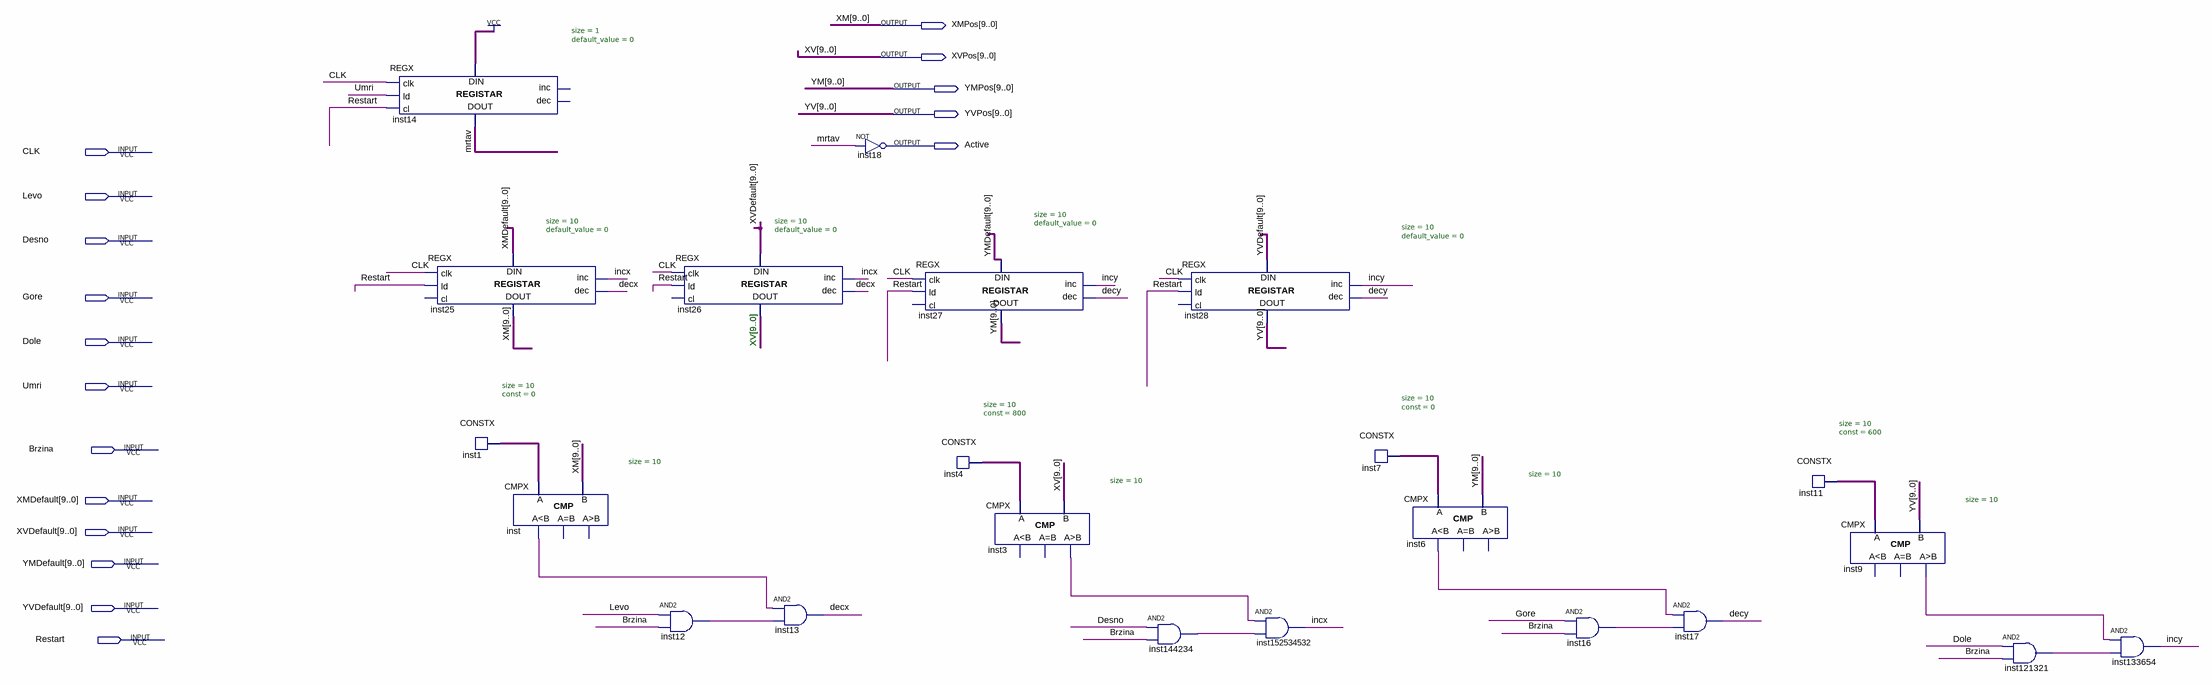
[diagram p0: schematic sheet]
// Quartus schematic objekat.bdf as structural Verilog: 22 symbols, 17 pins
module objekat (
  input  CLK,
  input  Levo,
  input  Desno,
  input  Gore,
  input  Dole,
  input  Umri,
  input  Brzina,
  input  [9:0] XMDefault,
  input  [9:0] XVDefault,
  input  [9:0] YMDefault,
  input  [9:0] YVDefault,
  input  Restart,
  output [9:0] XMPos,
  output [9:0] XVPos,
  output [9:0] YMPos,
  output [9:0] YVPos,
  output Active
);

  wire decx, decy, incx, incy, inst3_gr, inst6_ls, inst9_gr, inst12_out, inst16_out, inst121321_out,
       inst144234_out, inst_ls, mrtav;
  wire [9:0] inst1_data, inst4_data, inst7_data, inst11_data;

  REGX #(.size(1), .default_value(0)) inst14 (
    .clk(CLK), .ld(Umri), .cl(Restart), .data_in(1'b1), .data_out(mrtav));  // open: inc, dec
  REGX #(.size(10), .default_value(0)) inst25 (
    .clk(CLK), .ld(Restart), .inc(incx), .dec(decx), .data_in(XMDefault), .data_out(XMPos));  // open: cl
  CONSTX #(.size(10), .\const (0)) inst1 (.data(inst1_data));
  CMPX #(.size(10)) inst (.A(inst1_data), .B(XMPos), .ls(inst_ls));  // open: eq, gr
  REGX #(.size(10), .default_value(0)) inst26 (
    .clk(CLK), .ld(Restart), .inc(incx), .dec(decx), .data_in(XVDefault), .data_out(XVPos));  // open: cl
  and inst12 (inst12_out, Levo, Brzina);
  and inst13 (decx, inst_ls, inst12_out);
  not inst18 (Active, mrtav);
  REGX #(.size(10), .default_value(0)) inst27 (
    .clk(CLK), .ld(Restart), .inc(incy), .dec(decy), .data_in(YMDefault), .data_out(YMPos));  // open: cl
  CONSTX #(.size(10), .\const (800)) inst4 (.data(inst4_data));
  CMPX #(.size(10)) inst3 (.A(inst4_data), .B(XVPos), .gr(inst3_gr));  // open: ls, eq
  and inst144234 (inst144234_out, Desno, Brzina);
  REGX #(.size(10), .default_value(0)) inst28 (
    .clk(CLK), .ld(Restart), .inc(incy), .dec(decy), .data_in(YVDefault), .data_out(YVPos));  // open: cl
  and inst152534532 (incx, inst3_gr, inst144234_out);
  CONSTX #(.size(10), .\const (0)) inst7 (.data(inst7_data));
  CMPX #(.size(10)) inst6 (.A(inst7_data), .B(YMPos), .ls(inst6_ls));  // open: eq, gr
  and inst16 (inst16_out, Gore, Brzina);
  and inst17 (decy, inst6_ls, inst16_out);
  CONSTX #(.size(10), .\const (600)) inst11 (.data(inst11_data));
  CMPX #(.size(10)) inst9 (.A(inst11_data), .B(YVPos), .gr(inst9_gr));  // open: ls, eq
  and inst121321 (inst121321_out, Dole, Brzina);
  and inst133654 (incy, inst9_gr, inst121321_out);

  // Other names for the same wires on the sheet: XM[9:0] = XMPos; XV[9:0] = XVPos; YM[9:0] = YMPos; YV[9:0] = YVPos

  // Notes on the sheet:
  //   XV[9..0]
endmodule
